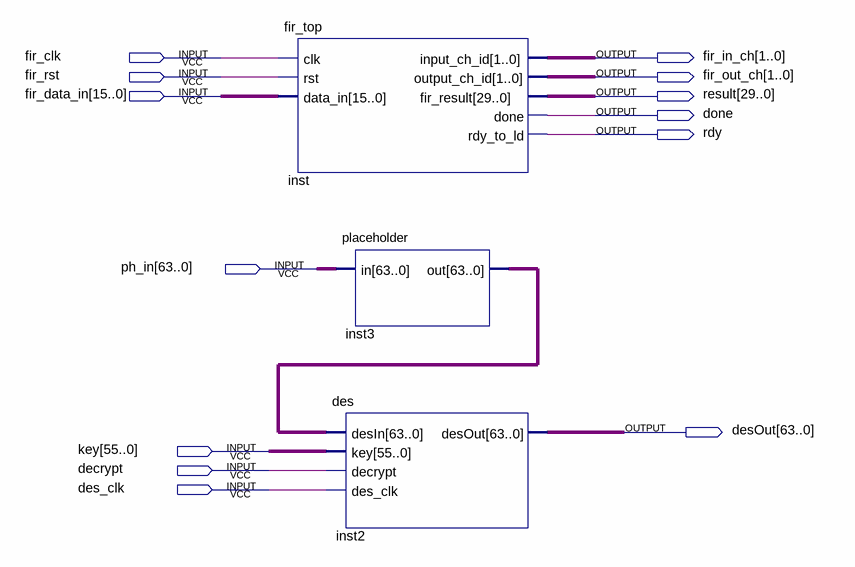
[diagram p0: schematic sheet]
// Quartus schematic top_qic.bdf as structural Verilog: 3 symbols, 13 pins
module top_qic (
  input  fir_clk,
  input  fir_rst,
  input  [15:0] fir_data_in,
  input  [63:0] ph_in,
  input  [55:0] key,
  input  decrypt,
  input  des_clk,
  output [1:0] fir_in_ch,
  output [1:0] fir_out_ch,
  output [29:0] result,
  output done,
  output rdy,
  output [63:0] desOut
);

  wire [63:0] inst3_out;

  fir_top inst (
    .clk(fir_clk), .rst(fir_rst), .data_in(fir_data_in), .input_ch_id(fir_in_ch), .output_ch_id(fir_out_ch),
    .fir_result(result), .done(done), .rdy_to_ld(rdy));
  placeholder inst3 (.in(ph_in), .out(inst3_out));
  des inst2 (.desIn(inst3_out), .key(key), .decrypt(decrypt), .des_clk(des_clk), .desOut(desOut));
endmodule
